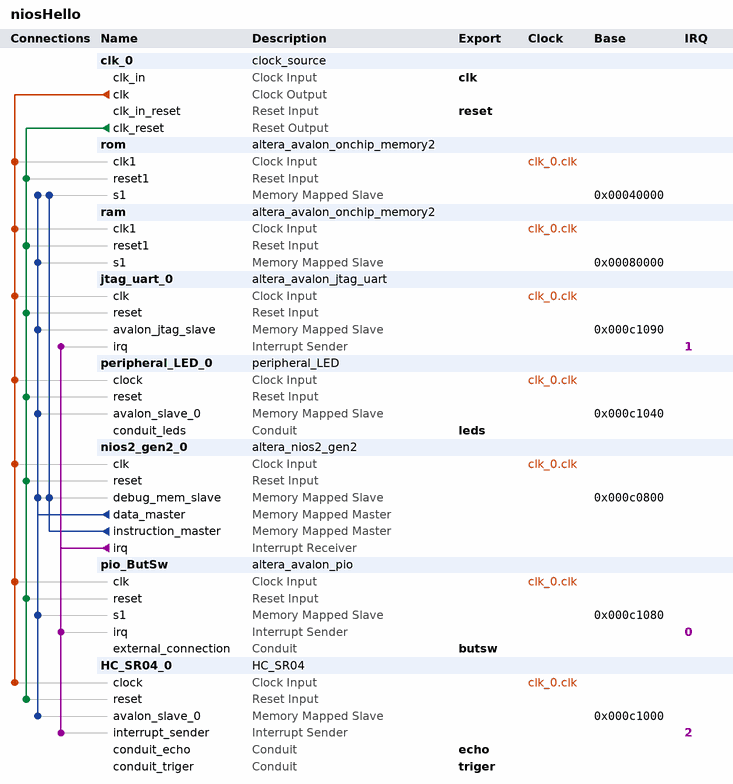
[diagram p0: system contents]
# Platform Designer (Qsys) system niosHello, Cyclone V 5CSEBA6U23I7
# Parameters at their usual value, and those the tool derives, are not listed.
package require -exact qsys 16.0
create_system niosHello
set_project_property DEVICE_FAMILY {Cyclone V}
set_project_property DEVICE 5CSEBA6U23I7

add_instance clk_0 clock_source 16.0
set_instance_parameter_value clk_0 clockFrequency 50000000

add_instance rom altera_avalon_onchip_memory2 16.0
set_instance_parameter_value rom dataWidth 32
set_instance_parameter_value rom dualPort false
set_instance_parameter_value rom initMemContent true
set_instance_parameter_value rom initializationFileName onchip_mem.hex
set_instance_parameter_value rom memorySize 262144

add_instance ram altera_avalon_onchip_memory2 16.0
set_instance_parameter_value ram dataWidth 32
set_instance_parameter_value ram dualPort false
set_instance_parameter_value ram initMemContent true
set_instance_parameter_value ram initializationFileName onchip_mem.hex
set_instance_parameter_value ram memorySize 262144

add_instance jtag_uart_0 altera_avalon_jtag_uart 16.0
set_instance_parameter_value jtag_uart_0 simInteractiveOptions NO_INTERACTIVE_WINDOWS

add_instance peripheral_LED_0 peripheral_LED 1.0
set_instance_parameter_value peripheral_LED_0 LEN 4

add_instance nios2_gen2_0 altera_nios2_gen2 16.0
set_instance_parameter_value nios2_gen2_0 dcache_size 2048
set_instance_parameter_value nios2_gen2_0 exceptionSlave rom.s1
set_instance_parameter_value nios2_gen2_0 icache_size 4096
set_instance_parameter_value nios2_gen2_0 impl Tiny
set_instance_parameter_value nios2_gen2_0 resetSlave rom.s1

add_instance pio_ButSw altera_avalon_pio 16.0
set_instance_parameter_value pio_ButSw captureEdge true
set_instance_parameter_value pio_ButSw direction Input
set_instance_parameter_value pio_ButSw edgeType ANY
set_instance_parameter_value pio_ButSw generateIRQ true
set_instance_parameter_value pio_ButSw irqType EDGE
set_instance_parameter_value pio_ButSw width 5

add_instance HC_SR04_0 HC_SR04 1.0
set_instance_parameter_value HC_SR04_0 LEN 4

# connections
add_connection clk_0.clk HC_SR04_0.clock clock
add_connection clk_0.clk jtag_uart_0.clk clock
add_connection clk_0.clk nios2_gen2_0.clk clock
add_connection clk_0.clk peripheral_LED_0.clock clock
add_connection clk_0.clk pio_ButSw.clk clock
add_connection clk_0.clk ram.clk1 clock
add_connection clk_0.clk rom.clk1 clock
add_connection clk_0.clk_reset HC_SR04_0.reset reset
add_connection clk_0.clk_reset jtag_uart_0.reset reset
add_connection clk_0.clk_reset nios2_gen2_0.reset reset
add_connection clk_0.clk_reset peripheral_LED_0.reset reset
add_connection clk_0.clk_reset pio_ButSw.reset reset
add_connection clk_0.clk_reset ram.reset1 reset
add_connection clk_0.clk_reset rom.reset1 reset
add_connection nios2_gen2_0.data_master HC_SR04_0.avalon_slave_0 avalon
set_connection_parameter_value nios2_gen2_0.data_master/HC_SR04_0.avalon_slave_0 baseAddress 0x000c1000
add_connection nios2_gen2_0.data_master jtag_uart_0.avalon_jtag_slave avalon
set_connection_parameter_value nios2_gen2_0.data_master/jtag_uart_0.avalon_jtag_slave baseAddress 0x000c1090
add_connection nios2_gen2_0.data_master nios2_gen2_0.debug_mem_slave avalon
set_connection_parameter_value nios2_gen2_0.data_master/nios2_gen2_0.debug_mem_slave baseAddress 0x000c0800
add_connection nios2_gen2_0.data_master peripheral_LED_0.avalon_slave_0 avalon
set_connection_parameter_value nios2_gen2_0.data_master/peripheral_LED_0.avalon_slave_0 baseAddress 0x000c1040
add_connection nios2_gen2_0.data_master pio_ButSw.s1 avalon
set_connection_parameter_value nios2_gen2_0.data_master/pio_ButSw.s1 baseAddress 0x000c1080
add_connection nios2_gen2_0.data_master ram.s1 avalon
set_connection_parameter_value nios2_gen2_0.data_master/ram.s1 baseAddress 0x00080000
add_connection nios2_gen2_0.data_master rom.s1 avalon
set_connection_parameter_value nios2_gen2_0.data_master/rom.s1 baseAddress 0x00040000
add_connection nios2_gen2_0.instruction_master nios2_gen2_0.debug_mem_slave avalon
set_connection_parameter_value nios2_gen2_0.instruction_master/nios2_gen2_0.debug_mem_slave baseAddress 0x000c0800
add_connection nios2_gen2_0.instruction_master rom.s1 avalon
set_connection_parameter_value nios2_gen2_0.instruction_master/rom.s1 baseAddress 0x00040000
add_connection nios2_gen2_0.irq HC_SR04_0.interrupt_sender interrupt
set_connection_parameter_value nios2_gen2_0.irq/HC_SR04_0.interrupt_sender irqNumber 2
add_connection nios2_gen2_0.irq jtag_uart_0.irq interrupt
set_connection_parameter_value nios2_gen2_0.irq/jtag_uart_0.irq irqNumber 1
add_connection nios2_gen2_0.irq pio_ButSw.irq interrupt
set_connection_parameter_value nios2_gen2_0.irq/pio_ButSw.irq irqNumber 0

# exported interfaces
add_interface butsw conduit end
set_interface_property butsw EXPORT_OF pio_ButSw.external_connection
add_interface clk clock sink
set_interface_property clk EXPORT_OF clk_0.clk_in
add_interface echo conduit end
set_interface_property echo EXPORT_OF HC_SR04_0.conduit_echo
add_interface leds conduit end
set_interface_property leds EXPORT_OF peripheral_LED_0.conduit_leds
add_interface reset reset sink
set_interface_property reset EXPORT_OF clk_0.clk_in_reset
add_interface triger conduit end
set_interface_property triger EXPORT_OF HC_SR04_0.conduit_triger

set_interconnect_requirement {$system} qsys_mm.clockCrossingAdapter HANDSHAKE
set_interconnect_requirement {$system} qsys_mm.enableEccProtection FALSE
set_interconnect_requirement {$system} qsys_mm.insertDefaultSlave FALSE
set_interconnect_requirement {$system} qsys_mm.maxAdditionalLatency 1

save_system niosHello.qsys
